# EAGLE design Loco-Micro (EAGLE 9.7.0)
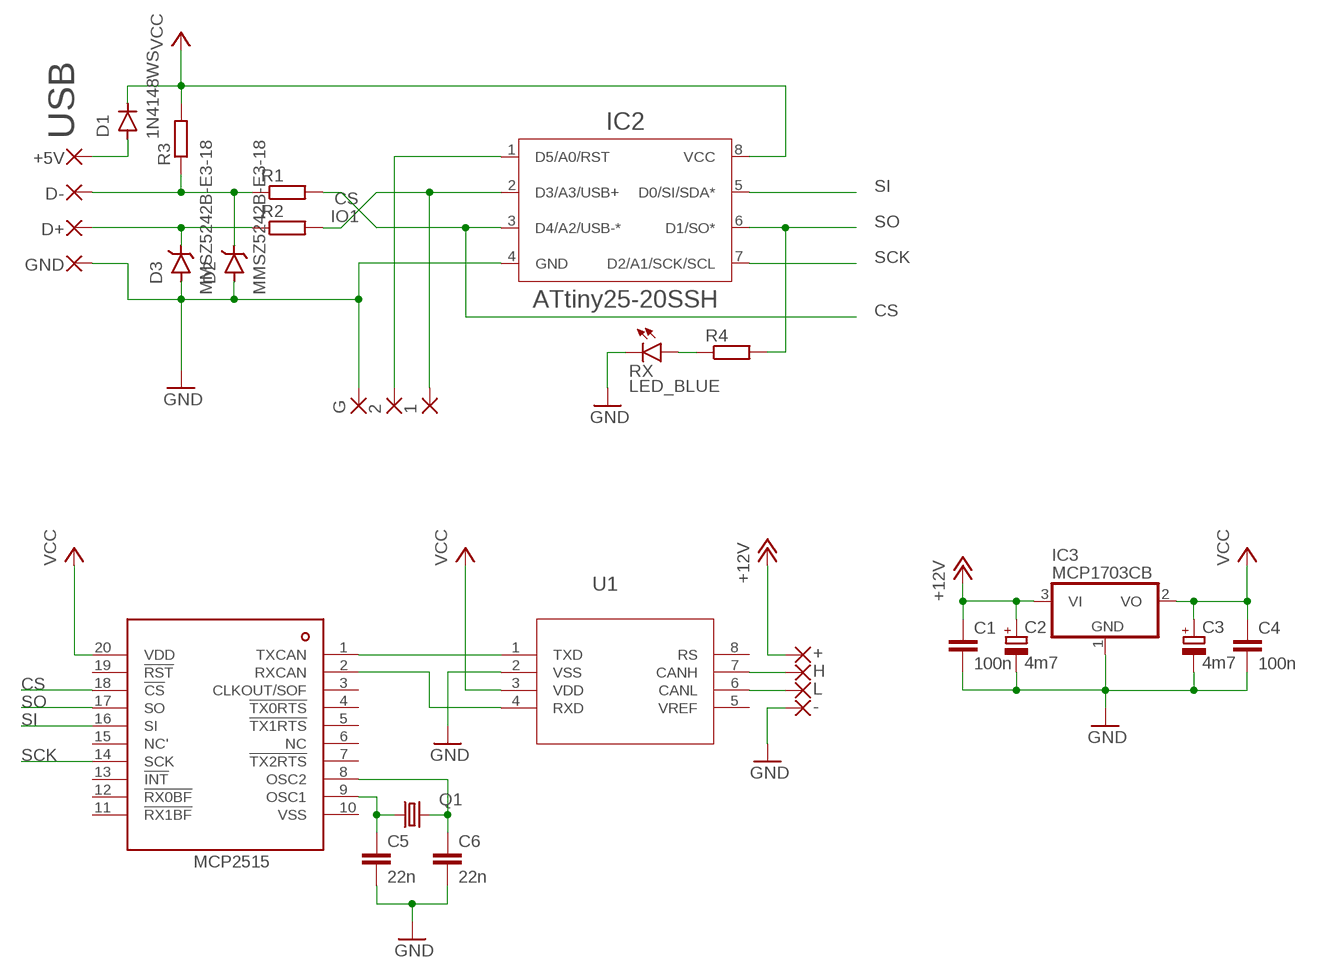
[diagram p0: schematic, sheet 1]

## Parts
1  1,6/0,8  [1,6/0,8]
2  1,6/0,8  [1,6/0,8]
+  1,6/0,8  [1,6/0,8]
+5V  SMD2  [SMD1,27-2,54]
-  1,6/0,8  [1,6/0,8]
C1  100n  C-EUC0402K  [C0402K]
C2  4m7  CPOL-EUCT3216  [CT3216]
C3  4m7  CPOL-EUCT3216  [CT3216]
C4  100n  C-EUC0402K  [C0402K]
C5  22n  C-EUC0402K  [C0402K]
C6  22n  C-EUC0402K  [C0402K]
D1  1N4148WS  [SOD-323]
D2  MMSZ5242B-E3-18  [SOD-123]
D3  MMSZ5242B-E3-18  [SOD-123]
D+  SMD2  [SMD1,27-2,54]
D-  SMD2  [SMD1,27-2,54]
G  1,6/0,8  [1,6/0,8]
GND  SMD2  [SMD1,27-2,54]
H  1,6/0,8  [1,6/0,8]
IC2  ATtiny25-20SSH  ATTINY25-20SSH-8PIN_SOIC  [SOIC127P600X175-8N]
IC3  MCP1703CB  [SOT23]
L  1,6/0,8  [1,6/0,8]
Q1  KX-9A  [5.0X3.2_KX-9A]
R1  R-EU_R0402  [R0402]
R2  R-EU_R0402  [R0402]
R3  R-EU_R0402  [R0402]
R4  R-EU_R0402  [R0402]
RX  LED_BLUE  CHIP-FLAT-B_0402  [LEDC1005X25N_FLAT-B]
U1  MCP2551-X/SNSOIC8-N_MC_MCH-L  [SOIC8-N_MC_MCH-L]
U$2  MCP2515  [TSSOP20]

## Nets
+12V: +.1(P) C1.1 C2.+ IC3.3(VI)
CS: IC2.3(D4/A2/USB-*) R1.2 U$2.18(!CS)
GND: -.1(P) C1.2 C2.- C3.- C4.2 C5.2 C6.2 D2.A D3.A G.1(P) GND.1(P) IC2.4(GND) IC3.1(GND) RX.C U1.2(VSS)
IO1: 1.1(P) IC2.2(D3/A3/USB+) R2.2
IO2: 2.1(P) IC2.1(D5/A0/RST)
N$1: C6.1 Q1.3 U$2.8(OSC2)
N$2: R4.1 RX.A
N$5: U1.1(TXD) U$2.1(TXCAN)
N$7: U1.4(RXD) U$2.2(RXCAN)
N$8: H.1(P) U1.7(CANH)
N$9: L.1(P) U1.6(CANL)
N$10: C5.1 Q1.1 U$2.9(OSC1)
SCK: IC2.7(D2/A1/SCK/SCL) U$2.14(SCK)
SI: IC2.5(D0/SI/SDA*) U$2.16(SI)
SO: IC2.6(D1/SO*) R4.2 U$2.17(SO)
USB_5V: +5V.1(P) D1.A
USB_D+: D3.C D+.1(P) R2.1
USB_D-: D2.C D-.1(P) R1.1 R3.1
VCC: C3.+ C4.1 D1.C IC2.8(VCC) IC3.2(VO) R3.2 U1.3(VDD) U$2.20(VDD)
Unconnected: U1.5(VREF) U1.8(RS) U$2.3(CLKOUT/SOF) U$2.4(!TX0RTS) U$2.5(!TX1RTS) U$2.6(NC) U$2.7(!TX2RTS) U$2.10(VSS) U$2.11(!RX1BF) U$2.12(!RX0BF) U$2.13(!INT) U$2.15(NC') U$2.19(!RST)

## Notes on the sheet
- USB

## Library data of the parts
1 2 + - G H L = wirepad:1,6/0,8: THROUGH-HOLE PAD
+5V D+ D- GND = wirepad:SMD2: SMD PAD
C1 C4-C6 = rcl:C-EU: CAPACITOR, European symbol; SPICEPREFIX: C
C2 C3 = rcl:CPOL-EU: POLARIZED CAPACITOR, European symbol; SPICEPREFIX: C
D1 = Diodes:1N4148WS: DIODE GEN PURP 75V 150MA SOD323F Manufacturer's datasheet <https://www.onsemi.com/pub/Collateral/1N914BWS-D.pdf>; CREATED_BY: PCBLayout.com; DIGIKEY_PART_NUMBER: 1N4148WSFSTR-ND; MANUFACTURER: Diodes Incorporated; MPN: 1N4148WS; PACKAGE: SOD-323
D2 D3 = Diodes-2:MMSZ5242B-E3-18: DIODE ZENER 12V 500MW SOD123 Manufacturer's datasheet <https://www.vishay.com/docs/85774/mmsz5225.pdf>; CREATED_BY: PCBLayout.com; DIGIKEY_PARTNO: MMSZ5242B-E3-18GICT-ND; MANUFACTURER: Vishay General Semiconductor - Diodes Division; MPN: MMSZ5242B-E3-18; PACKAGE: SOD-123
IC2 = ATtiny:ATTINY*-8PIN: Atmel tiny25/45/85, 8-bit AVR Microcontroller with 2/4/8K Bytes In-System Programmable Flash Datasheet <https://ww1.microchip.com/downloads/en/DeviceDoc/Atmel-2586-AVR-8-bit-Microcontroller-ATtiny25-ATtiny45-ATtiny85_Datasheet.pdf>; CATEGORY: IC_Embedded; CORE: AVR; DESCRIPTION: AVR AVR® ATtiny, Functional Safety (FuSa) Microcontroller IC 8-Bit 20MHz 2KB (1K x 16) FLASH 8-SOIC; MANUFACTURER: Microchip Technology; MPN: ATtiny25-20SSH; OPERATING_TEMP: -40°C to 85°C; PART_STATUS: Active; ROHS_COMPLIANT: COMPLIANT; SERIES: ATtiny25; SPEED: 20 MHz; SUB-CATEGORY: Microcontroller; TYPE: 8 bit Microcontroller
IC3 = linear:MCP1703: 250 mA, 16V, Low Quiescent Current LDO Regulator Source: http://ww1.microchip.com/downloads/en/DeviceDoc/22049b.pdf
Q1 = Crystals:KX: Quartz Crystals (MHz) SMD: KX - Serie Model Size l/w/h [mm] Frequency Range Frequency Stability Temp. Range [°C] Load Capacitance AECQ 200 availabel Datasheet KX-4 KX-5 KX-6 KX-7 KX-9A KX-9B KX-12A KX-12B KX-13 KX-20 KX-K KX-KS 1.6/1.2/0.3 2.0/1.6/0.45 2.5/2.0/0.55 3.2/2.5/0.8 5.0/3.2/1.0 5.0/3.2/1.1 6.0/3.5/1.1 6.0/3.5/1.0 7.0/5.0 /1.3 11.6/5.5/1.6 12.3/4.5/4.2 12.3/4.5/3.2 24.0 ~ 80.0 MHz 16.0 ~ 80.0 MHz 12.0 ~ 80.0 MHz 8.0 ~ 60.0 MHz 7,68 ~ 300,0 MHz 8,0 ~ 50,0 MHz 8,0 ~ 150,0 MHz 8,0 ~ 50,0 MHz 6,0 ~ 160,0 MHz 3,579 ~ 25,0 MHz 3,579 ~ 70,0 MHz 3,579 ~ 70,0 MHz ±10 … ±50ppm ±10 … ±50ppm ±10 … ±50ppm ±10 … ±50ppm ±10 … ±50ppm ±10 … ±50ppm ±10 … ±50ppm ±10 … ±50ppm ±10 … ±50ppm ±50ppm ±10 … ±50ppm ±10 … ±50ppm (*) -40°C …+85°C (*) -40°C …+125°C (*) -40°C …+125°C (*) -40°C …+125°C (*) -40°C …+105°C (*) -40°C …+105°C (*) -40°C …+125°C (*) -40°C …+105°C (*) -40°C …+105°C (*) -40°C …+105°C (*) -40°C …+85°C (*) -40°C …+85°C 8, 8…16 8, 8…16 10, 8…16 12, 7…20 16, 10…20 16, 10…20 16, 10…20 16, 12…20 16, 12…20 16, 12…20 16, 12…30 16, 12…30 - yes yes yes - - - - - - - - KX-4.pdf <http://www.geyer-electronic.de/uploads/tx_userartikelfrequenz/GEYER-KX-4.pdf> KX-5.pdf <http://www.geyer-electronic.de/uploads/tx_userartikelfrequenz/GEYER-KX-5.pdf> KX-6.pdf <http://www.geyer-electronic.de/uploads/tx_userartikelfrequenz/GEYER-KX-6.pdf> KX-7.pdf <http://www.geyer-electronic.de/uploads/tx_userartikelfrequenz/GEYER-KX-7.pdf> KX-9A.pdf <http://www.geyer-electronic.de/uploads/tx_userartikelfrequenz/GEYER-KX-9A.pdf> KX-9B.pdf <http://www.geyer-electronic.de/uploads/tx_userartikelfrequenz/GEYER-KX-9B.pdf> KX-12A.pdf <http://www.geyer-electronic.de/uploads/tx_userartikelfrequenz/GEYER-KX-12A.pdf> KX-12B.pdf <http://www.geyer-electronic.de/uploads/tx_userartikelfrequenz/GEYER-KX-12B.pdf> KX-13.pdf <http://www.geyer-electronic.de/uploads/tx_userartikelfrequenz/GEYER-KX-13.pdf> KX-20.pdf <http://www.geyer-electronic.de/uploads/tx_userartikelfrequenz/GEYER-KX-20.pdf> KX-K.pdf <http://www.geyer-electronic.de/uploads/tx_userartikelfrequenz/GEYER-KX-K.pdf> KX-KS.pdf <http://www.geyer-electronic.de/uploads/tx_userartikelfrequenz/GEYER-KX-KS.pdf> <http://www.geyer-electronic.de/fileadmin/template/img/logo-geyer-electronic.png> Details see: http://www.geyer-electronic.de/Frequenz-Produkte.9.0.html Created 2016-06-07, Hans Locher 2016 (C) Geyer Quartz Technology KX4,KX5,KX6,KX7,KX9A,KX9B,KX12A,KX12B,KX13,KX20,KXK,KXKS;1612;2016;2520;3225;5032;6035;7050;11655;12345;1,6x1,2;2,0x1,6;2,5x2,0;3,2x2,5;5,0x3,2;6,0x3,5;7,0x5,0;11,6x5,5;12,3x4,5;12,3x4,5;1.6x1.2;2.0x1.6;2.5x2.0;3.2x2.5;5.0x3.2;6.0x3.5;7.0x5.0;11.6x5.5;12.3x4.5;12.3x4.5;
R1-R4 = rcl:R-EU_: RESISTOR, European symbol; SPICEPREFIX: R
RX = LED:CHIP-FLAT-B; CATEGORY: LED; COLOR: BLUE; DESCRIPTION: CHIP LED FLAT; SUB-CATEGORY: CHIP; TYPE: FLAT_TOP
U1 = MCP2551:MCP2551-X/SN; COPYRIGHT: Copyright (C) 2023 Ultra Librarian. All rights reserved.; MANUFACTURER_PART_NUMBER: MCP2551-X/SN; MFR_NAME: Microchip
U$2 = MCP2515:MCP2515: Microchip Technology’s MCP2515 is a stand-alone Controller Area Network (CAN) controller that implements the CAN specification, version 2.0B. It is capable of transmitting and receiving both standard and extended data and remote frames. The MCP2515 has two acceptance masks and six acceptance filters that are used to filter out unwanted messages, thereby reducing the host MCUs overhead. The MCP2515 interfaces with microcontrollers (MCUs) via an industry standard Serial Peripheral Interface (SPI).

## Board
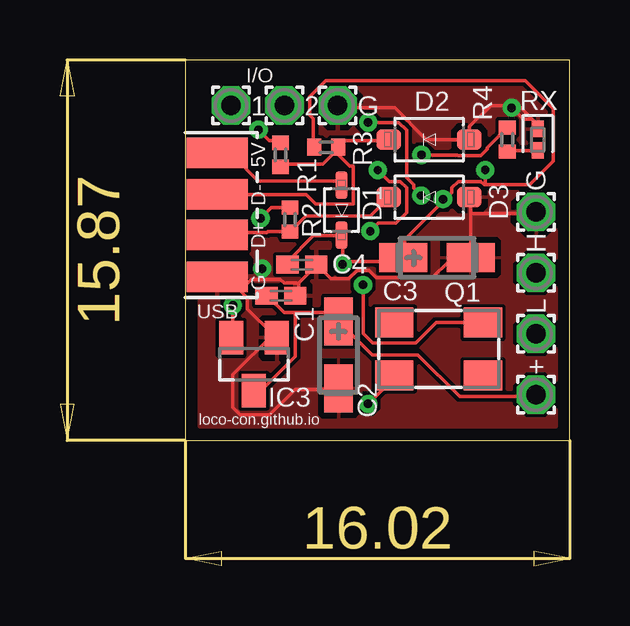
[diagram p1: board, top side]
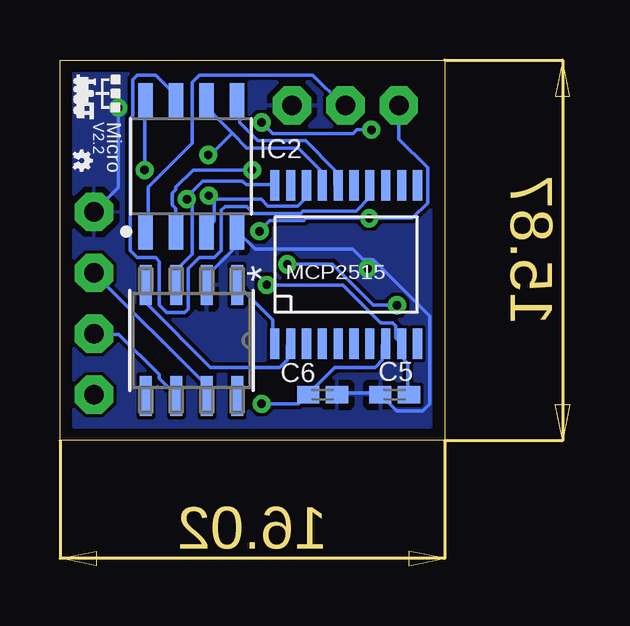
[diagram p2: board, bottom side, seen from below]

Size 16.02 x 15.87 mm. Coordinates in mm from the lower left corner, seen from the top.
Outline: 0,0 16.02,0 16.02,15.87 0,15.87 0,0
Copper layers (1*16): Top / Bottom
Stack-up Default Layer Stack: Top User Defined 0.035mm / Dielectric-1 User Defined 1.5mm / Bottom User Defined 0.035mm
Design rules "default *": minimum track width 6mil, minimum drill 0.35mm, track to track 6mil, track to pad 6mil, pad to pad 6mil, via to via 6mil, smd to smd 6mil, copper to edge 20mil, drill to drill 6mil, minimum pad ring 10mil, minimum via ring 8mil, stop-mask expansion 4mil, vias tented up to drill 0mil, thermal gap 10mil

### Footprints (pad centres in the part's own frame; a part is rotated, then mirrored left to right if it is on the bottom)
1,6/0,8 = drill 0.813 pad 1.6 octagon: 1 0,0
SMD1,27-2,54 = smd 1.27 x 2.54: 1 0,0
C0402K = smd 0.925 x 0.74: 1 -0.6,0; 2 0.6,0
CT3216 = smd 2 x 1.2: + -1.4,0; - 1.4,0
SOD-323 = smd 1.14 x 0.52: A 1.04,0; C -1.04,0
SOD-123 = smd 1.02 x 0.86: A 1.68,0; C -1.68,0
SOIC127P600X175-8N = smd 1.55 x 0.6: 1 -2.7,1.905; 2 -2.7,0.635; 3 -2.7,-0.635; 4 -2.7,-1.905; 5 2.7,-1.905; 6 2.7,-0.635; 7 2.7,0.635; 8 2.7,1.905
SOT23 = smd 1 x 1.4: 1 -0.95,-1.1; 2 0.95,-1.1; 3 0,1.1
5.0X3.2_KX-9A = smd 1.6 x 1.25: 1 -1.85,-1.1; 2 1.85,-1.1; 3 1.85,1.1; 4 -1.85,1.1
R0402 = smd 0.6 x 0.7: 1 -0.5,0; 2 0.5,0
LEDC1005X25N_FLAT-B = smd 0.7 x 0.5: A 0.45,0; C -0.45,0
SOIC8-N_MC_MCH-L = smd 1.676 x 0.508: 1 -2.311,1.905; 2 -2.311,0.635; 3 -2.311,-0.635; 4 -2.311,-1.905; 5 2.311,-1.905; 6 2.311,-0.635; 7 2.311,0.635; 8 2.311,1.905
TSSOP20 = smd 1.27 x 0.381: 1 -3.302,2.642; 2 -3.302,1.981; 3 -3.302,1.321; 4 -3.302,0.66; 5 -3.302,0; 6 -3.302,-0.66; 7 -3.302,-1.321; 8 -3.302,-1.981; 9 -3.302,-2.642; 10 -3.302,-3.302; 11 3.302,-3.302; 12 3.302,-2.642; 13 3.302,-1.981; 14 3.302,-1.321; 15 3.302,-0.66; 16 3.302,0; 17 3.302,0.66; 18 3.302,1.321; 19 3.302,1.981; 20 3.302,2.642

### Placement (x,y rotation side)
1  1.91,13.97 0 top
2  4.13,13.97 0 top
+  14.61,1.91 0 top
+5V  1.33,11.99 90 top
-  14.61,9.53 0 top
C1  3.98,6.03 0 top
C2  6.39,3.57 270 top
C3  10.48,7.62 0 top
C4  4.86,7.33 0 top
C5  2.08,1.91 180 bottom
C6  5.08,1.91 0 bottom
D1  6.51,9.6 90 top
D2  10.16,12.54 0 top
D3  10.16,10.14 0 top
D+  1.33,8.57 90 top
D-  1.33,10.25 90 top
G  6.35,13.97 0 top
GND  1.33,6.83 90 top
H  14.61,6.99 0 top
IC2  10.56,11.43 90 bottom
IC3  2.86,3.17 180 top
L  14.61,4.45 0 top
Q1  10.56,3.81 180 top
R1  3.97,11.91 90 top
R2  4.37,9.21 90 top
R3  5.87,12.22 180 top
R4  13.41,12.54 90 top
RX  14.68,12.54 270 top
U1  10.54,4.17 270 bottom
U$2  4.43,7.33 90 bottom

### Tracks (layer width: path | path; a pad name or v marks a point on that pad's centre or on a via)
+12V
  Top 0.152: 4.57,5.33 6.1,5.33 6.25,5.18 6.25,5.1 C2.+ 7.79,3.56 9.7,3.56 11.43,1.83 14.48,1.83 +.1 | 4.57,5.33 4.12,5.33 3.5,5.94 C1.1 | 4.57,5.33 4.57,3.5 3.2,2.13 2.9,2.13 IC3.3
CS  (via drill 0.35)
  Top 0.152: v3.05,12.95 3.5,12.5 3.96,12.5 R1.2 | v7.62,13.26 8.9,13.26 9.22,12.94 9.22,10.97 9.52,10.66 9.52,10.51 v9.82,10.21
  Bottom 0.152: v3.05,12.95 3.66,12.95 3.81,12.8 7.16,12.8 v7.62,13.26 | 9.6,10.06 9.6,9.14 9.91,8.84 IC2.3 | U$2.18 5.79,10.52 5.79,10.11 6.12,9.77 7.36,9.77 7.64,10.06 9.6,10.06 | 9.6,10.06 9.75,10.21 v9.82,10.21
GND  (via drill 0.35)
  Top 0.152: G.1 6.4,13.87 8.72,13.87 10.05,12.54 D2.A 11.84,13.07 12.73,13.97 13.89,13.97 14.46,13.4 | 11.89,9.45 C3.- 11.73,7.47 10.97,7.47 10.3,6.79 7.96,6.79 7.66,7.09 7.16,7.09 6.8,6.74 6.06,6.74 5.49,7.32 | 11.89,9.45 11.89,9.99 D3.A | 11.89,9.45 14.48,9.45 -.1 | 4.72,6.55 4.72,6.1 C1.2 | 5.49,7.32 4.72,6.55 | 3.66,4.42 2.59,5.49 2.59,5.94 2.29,6.25 | 2.29,6.25 1.83,6.71 1.37,6.71 GND.1 2.29,6.25 | 4.72,6.55 4.12,6.55 3.96,6.71 3.2,6.71 | 3.2,6.71 2.74,6.71 2.29,6.25 | 3.66,4.42 1.98,2.74 1.98,1.37 2.29,1.07 3.5,1.07 4.57,2.13 6.35,2.13 C2.- | 3.66,4.42 IC3.1 | 5.49,7.32 C4.2 | 3.2,6.71 v3.2,7.16 | RX.C 14.69,13.17 14.46,13.4 | 14.46,13.4 14.07,13.4 v13.6,13.87
  Bottom 0.152: C6.2 4.42,1.98 2.74,1.98 C5.2 2.59,1.83 1.98,1.22 0.91,1.22 0.61,1.52 0.61,5.18 2.9,7.47 | U1.2 9.91,6.86 8.69,8.08 8.69,8.69 IC2.4 7.89,7.97 3.82,7.97 3.38,7.54 2.96,7.54 2.9,7.47 | v3.2,7.16 2.9,7.47 | -.1 13.6,10.53 v13.6,13.87
  pour Top: 0,15.88 0,0 16.03,0 16.03,15.88
  pour Bottom: 0,15.88 16.03,15.88 16.03,0 0,0
IO1  (via drill 0.35)
  Top 0.152: v3.13,9.26 3.58,9.71 R2.2 | v7.71,8.72 8.04,9.06 8.77,9.06 9.22,9.51 9.22,10.54 8.96,10.8 8.49,10.8 v8.02,11.27
  Bottom 0.152: 1.1 1.91,12.56 0.71,11.37 0.71,9.91 1.35,9.26 v3.13,9.26 5.77,9.26 5.87,9.16 7.29,9.16 7.71,8.74 v7.71,8.72 | v8.02,11.27 10.48,11.27 11.19,10.56 11.19,10.46 11.34,10.31 11.34,9.81 11.19,9.66 IC2.2
IO2
  Bottom 0.152: IC2.1 12.34,8.84 12.34,10.57 10.52,12.4 10.52,14.94 10.21,15.24 5.49,15.24 4.27,14.02 2.1
N$1  (via drill 0.35)
  Top 0.152: v7.62,1.52 8.69,2.59 Q1.3
  Bottom 0.152: U$2.8 2.59,3.96 2.59,3.35 2.9,3.05 4.57,3.05 5.64,1.98 C6.1 5.79,1.83 6.1,1.52 v7.62,1.52
N$2
  Top 0.152: RX.A 13.49,12.09 13.49,12.04 R4.1
N$5
  Bottom 0.152: U$2.1 7.16,4.12 7.16,5.03 8.53,6.4 U1.1
N$7
  Bottom 0.152: U$2.2 6.55,3.96 6.55,3.35 6.86,3.05 9.75,3.05 12.34,5.64 12.34,6.4 U1.4
N$8
  Bottom 0.152: U1.7 9.91,2.29 H.1
N$9
  Bottom 0.152: U1.6 11.28,1.98 11.89,2.59 11.89,2.74 13.56,4.42 14.48,4.42 L.1
N$10  (via drill 0.35)
  Top 0.152: Q1.1 10.46,4.91 9.6,4.06 7.81,4.06 7.41,4.46 v7.41,6.48
  Bottom 0.152: C5.1 1.52,1.98 1.52,3.2 1.68,3.35 1.68,3.96 U$2.9 2.03,4.27 2.03,4.76 2.16,4.9 2.65,4.9 4.24,6.48 v7.41,6.48
SCK
  Bottom 0.152: IC2.7 11.28,14.17 11.28,14.48 12.04,15.24 12.8,15.24 12.99,15.05 12.99,13.54 13.1,13.43 13.1,7.92 12.8,7.62 12.04,7.62 11.89,7.47 11.89,5.64 11.58,5.33 10.82,5.33 10.67,5.49 10.67,7.16 10.21,7.62 9.6,7.62 9.3,7.92 9.3,9.6 9.14,9.75 8.23,9.75 7.94,9.47 6,9.47 5.9,9.57 3.69,9.57 3.11,10.15 U$2.14
SI
  Bottom 0.152: U$2.16 4.57,10.67 4.57,11.28 5.79,12.5 7.77,12.5 8.53,13.26 8.53,14.02 IC2.5
SO  (via drill 0.35)
  Top 0.152: R4.2 12.58,12.21 12.58,12.14 12.32,11.88 11.36,11.88 11.34,11.91 v9.84,11.91
  Bottom 0.152: 8.85,12.82 10.06,14.02 IC2.6 | 8.85,12.82 8.23,12.19 6.1,12.19 5.18,11.28 5.18,10.67 U$2.17 | v9.84,11.91 9.76,11.91 8.85,12.82
USB_5V
  Top 0.152: D1.A 6.32,10.82 3.05,10.82 1.98,11.89 1.37,11.89 +5V.1
USB_D+
  Top 0.152: D+.1 1.42,8.66 3.38,8.66 3.44,8.71 R2.1 5.02,9.36 7.7,9.36 D3.C
USB_D-
  Top 0.152: 6.25,12.04 6.4,12.19 R3.1 | D2.C 8.38,12.5 6.55,12.5 6.4,12.34 R3.1 | 6.25,12.04 R3.1 | 6.25,12.04 5.73,11.52 4.08,11.52 R1.1 | D-.1 5.03,10.25 5.44,9.85 7,9.85 7,11.44 6.84,11.44 6.25,12.04
VCC  (via drill 0.35)
  Top 0.152: C4.1 4.27,7.47 5.33,8.53 6.48,8.53 D1.C 6.55,8.52 6.55,7.47 | v1.98,5.64 1.98,4.42 IC3.2 | 10.67,9.91 9.14,8.38 9.14,7.62 C3.+ 8.99,7.47 6.55,7.47 | R3.2 5.33,12.34 5.33,13.41 5.18,13.56 5.18,14.33 5.86,15 14.16,15 15.32,13.83 15.32,11.65 14.34,10.67 12.5,10.67 | 12.5,10.67 v12.5,11.28 | 6.55,7.47 v6.55,7.35 | 10.67,9.91 10.67,9.99 v10.73,10.06 | 10.67,9.91 11.1,10.34 11.1,10.54 11.36,10.8 12.32,10.8 12.45,10.67 12.5,10.67
  Bottom 0.152: 10.52,10.06 10.52,7.77 11.12,7.16 11.12,6.55 U1.3 | v12.5,11.28 12.5,14.1 IC2.8 | v1.98,5.64 2.96,5.64 4.67,7.35 v6.55,7.35 | U$2.20 7.1,10.66 8.27,10.66 8.42,10.82 10.07,10.82 10.52,10.38 10.52,10.06 | 10.52,10.06 v10.73,10.06

### Text on the board
tNames: I/O | 5V | D- | G | D+ | G | USB | loco-con.github.io
bNames: Micro | V2.2